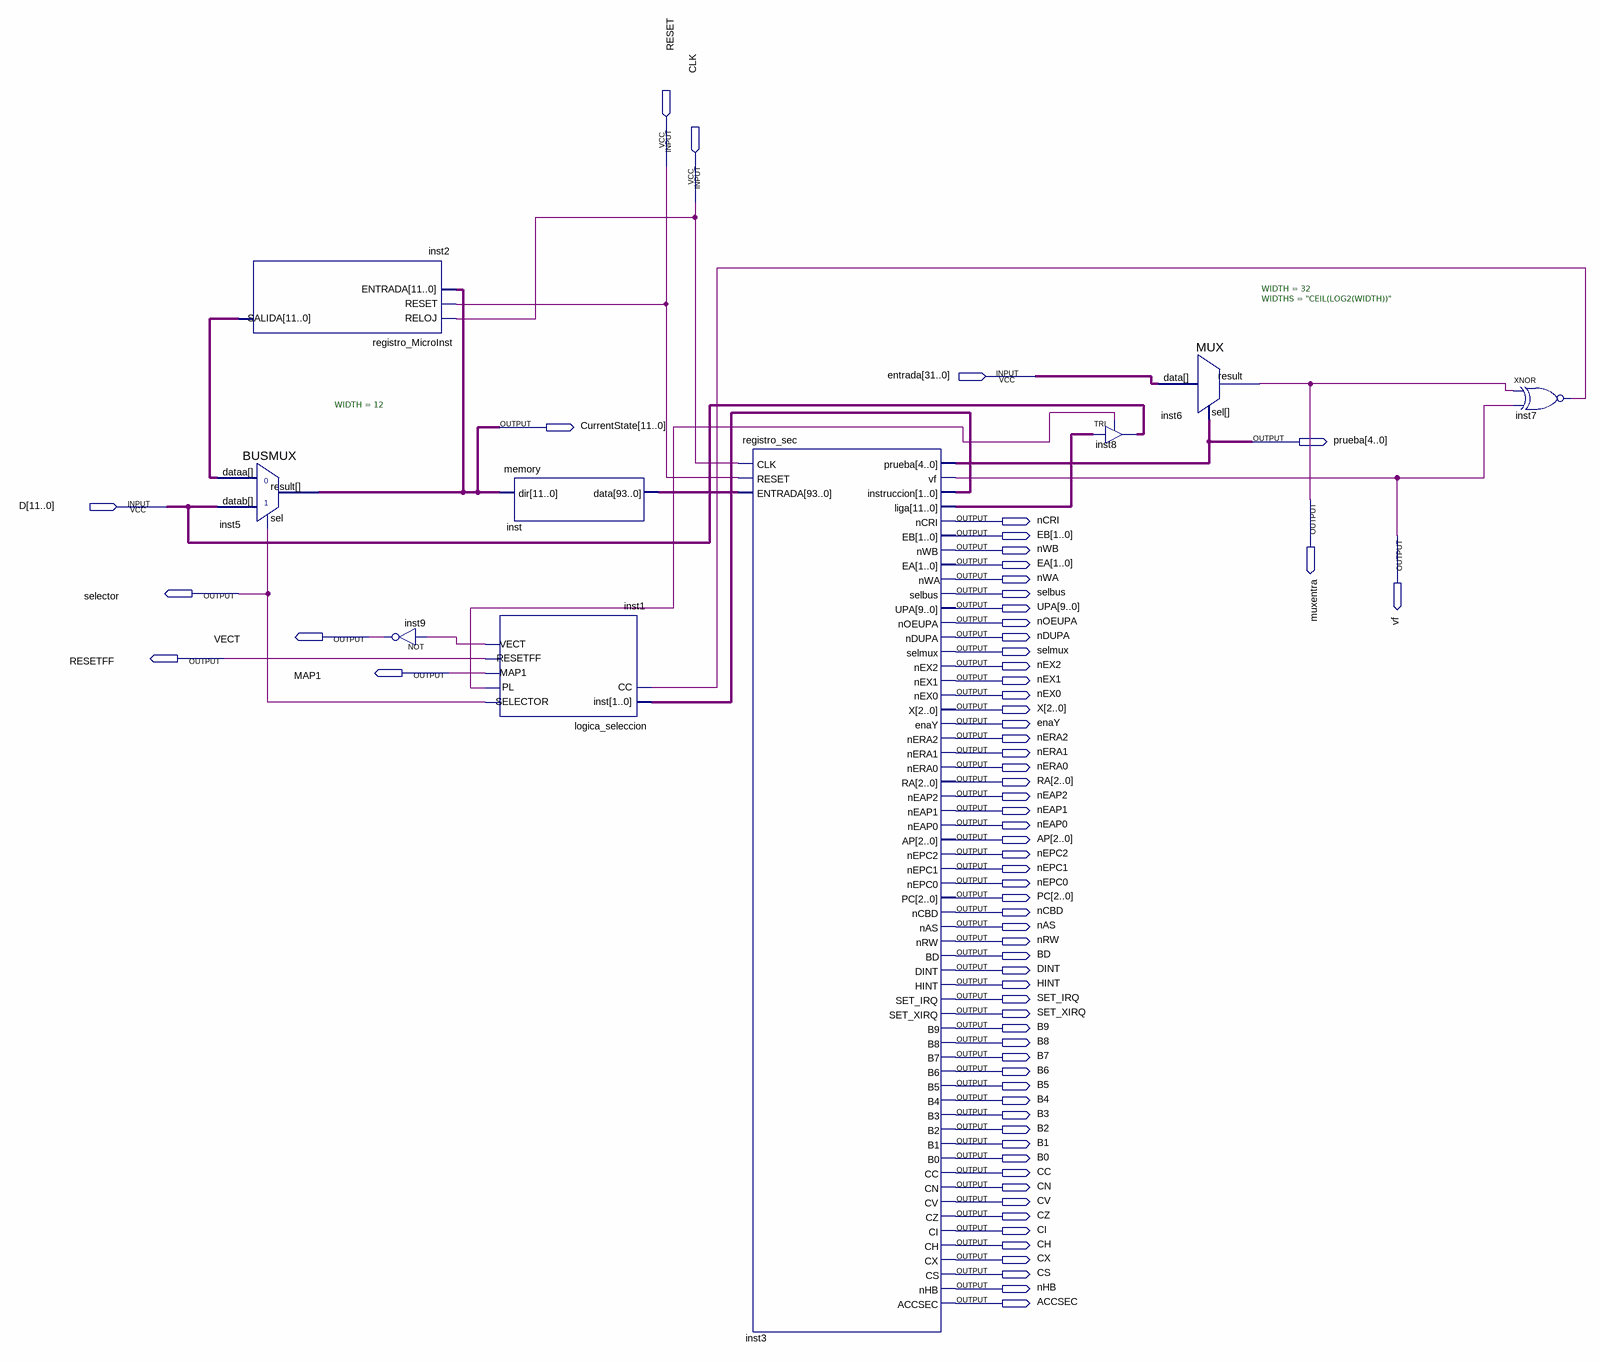
[diagram p0: schematic sheet]
// Quartus schematic secuenciador.bdf as structural Verilog: 9 symbols, 67 pins
module secuenciador (
  input  RESET,
  input  CLK,
  input  [31:0] entrada,
  input  [11:0] D,
  output [11:0] CurrentState,
  output [4:0] prueba,
  output muxentra,
  output nCRI,
  output [1:0] EB,
  output vf,
  output nWB,
  output [1:0] EA,
  output nWA,
  output selector,
  output selbus,
  output [9:0] UPA,
  output nOEUPA,
  output VECT,
  output nDUPA,
  output selmux,
  output RESETFF,
  output nEX2,
  output MAP1,
  output nEX1,
  output nEX0,
  output [2:0] X,
  output enaY,
  output nERA2,
  output nERA1,
  output nERA0,
  output [2:0] RA,
  output nEAP2,
  output nEAP1,
  output nEAP0,
  output [2:0] AP,
  output nEPC2,
  output nEPC1,
  output nEPC0,
  output [2:0] PC,
  output nCBD,
  output nAS,
  output nRW,
  output BD,
  output DINT,
  output HINT,
  output SET_IRQ,
  output SET_XIRQ,
  output B9,
  output B8,
  output B7,
  output B6,
  output B5,
  output B4,
  output B3,
  output B2,
  output B1,
  output B0,
  output CC,
  output CN,
  output CV,
  output CZ,
  output CI,
  output CH,
  output CX,
  output CS,
  output nHB,
  output ACCSEC
);

  wire inst1_pl, inst1_vect, inst7_out;
  wire [1:0] inst3_instruccion;
  wire [11:0] inst2_salida, inst3_liga;
  wire [93:0] inst_data;

  registro_MicroInst inst2 (.RELOJ(CLK), .RESET(RESET), .ENTRADA(CurrentState), .SALIDA(inst2_salida));
  BUSMUX #(.WIDTH(12)) inst5 (.datab(D), .sel(selector), .dataa(inst2_salida), .result(CurrentState));
  not inst9 (VECT, inst1_vect);
  memory inst (.dir(CurrentState), .data(inst_data));
  logica_seleccion inst1 (
    .inst(inst3_instruccion), .CC(inst7_out), .SELECTOR(selector), .PL(inst1_pl), .MAP1(MAP1),
    .RESETFF(RESETFF), .VECT(inst1_vect));
  registro_sec inst3 (
    .CLK(CLK), .RESET(RESET), .ENTRADA(inst_data), .prueba(prueba), .vf(vf), .instruccion(inst3_instruccion),
    .liga(inst3_liga), .nCRI(nCRI), .EB(EB), .nWB(nWB), .EA(EA), .nWA(nWA), .selbus(selbus), .UPA(UPA),
    .nOEUPA(nOEUPA), .nDUPA(nDUPA), .selmux(selmux), .nEX2(nEX2), .nEX1(nEX1), .nEX0(nEX0), .X(X),
    .enaY(enaY), .nERA2(nERA2), .nERA1(nERA1), .nERA0(nERA0), .RA(RA), .nEAP2(nEAP2), .nEAP1(nEAP1),
    .nEAP0(nEAP0), .AP(AP), .nEPC2(nEPC2), .nEPC1(nEPC1), .nEPC0(nEPC0), .PC(PC), .nCBD(nCBD), .nAS(nAS),
    .nRW(nRW), .BD(BD), .DINT(DINT), .HINT(HINT), .SET_IRQ(SET_IRQ), .SET_XIRQ(SET_XIRQ), .B9(B9), .B8(B8),
    .B7(B7), .B6(B6), .B5(B5), .B4(B4), .B3(B3), .B2(B2), .B1(B1), .B0(B0), .CC(CC), .CN(CN), .CV(CV),
    .CZ(CZ), .CI(CI), .CH(CH), .CX(CX), .CS(CS), .nHB(nHB), .ACCSEC(ACCSEC));
  TRI inst8[11:0] (.IN(inst3_liga), .OE(inst1_pl), .OUT(D));
  MUX #(.WIDTH(32), .WIDTHS("CEIL(LOG2(WIDTH))")) inst6 (.data(entrada), .sel(prueba), .result(muxentra));
  xnor inst7 (inst7_out, muxentra, vf);
endmodule
